# Altium project BLDC.PrjPcb
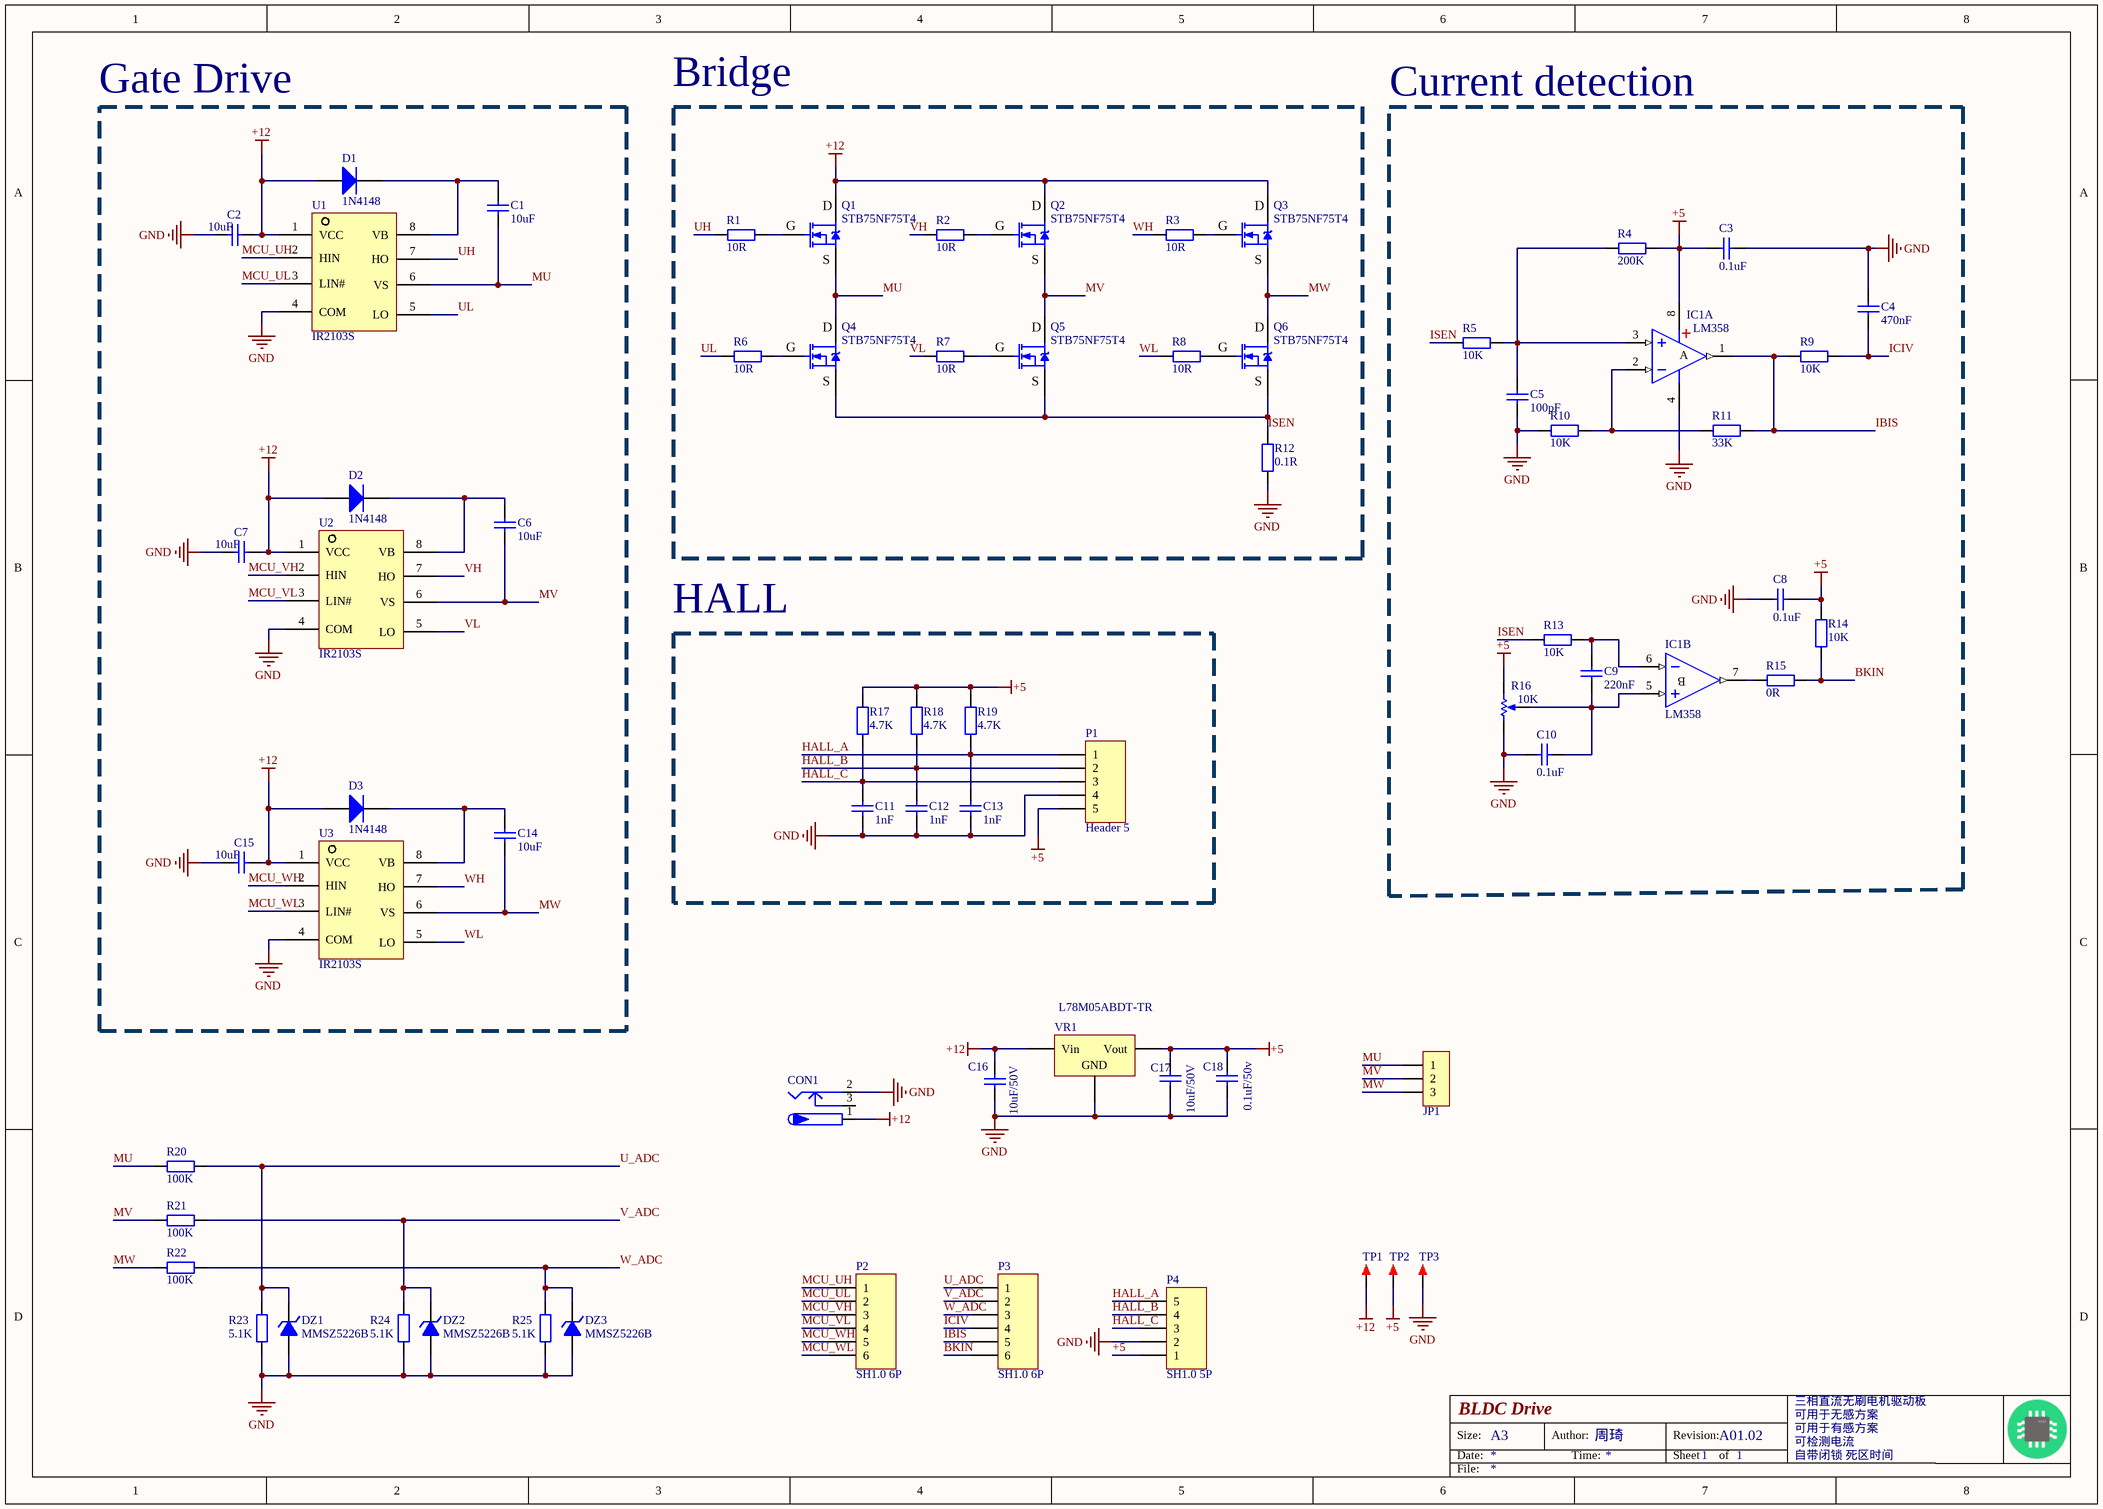
[diagram p0: 原理图.SchDoc]
1 sheet, 69 parts. Net scope: global (net labels, ports and power ports of the same name join across sheets).
Board file: PCB.PcbDoc

## Sheet 原理图.SchDoc: BLDC Drive
size A3; Author: 周琦; Organization: 三相直流无刷电机驱动板; Address1: 可用于无感方案; Address2: 可用于有感方案; Address3: 可检测电流; Address4: 自带闭锁 死区时间; Revision: A01.02; SheetNumber: 1; SheetTotal: 1; ImagePath: 1

### Parts
C1  10uF  [C0603_L]
C2  10uF  [C0603_L]
C3  0.1uF  [C0603_L]
C4  470nF  [C0603_L]
C5  100pF  [C0603_L]
C6  10uF  [C0603_L]
C7  10uF  [C0603_L]
C8  0.1uF  [C0603_L]
C9  220nF  [C0603_L]
C10  0.1uF  [C0603_L]
C11  1nF  [C0603_L]
C12  1nF  [C0603_L]
C13  1nF  [C0603_L]
C14  10uF  [C0603_L]
C15  10uF  [C0603_L]
C16  10uF/50V  [C1206_L]
C17  10uF/50V  [C1206_L]
C18  0.1uF/50v  [C0603_L]
CON1  3.5*1.3  [DC-005]  (value not drawn)
D1  1N4148  [SOD-123]
D2  1N4148  [SOD-123]
D3  1N4148  [SOD-123]
DZ1  MMSZ5226B  [SOD-123]
DZ2  MMSZ5226B  [SOD-123]
DZ3  MMSZ5226B  [SOD-123]
IC1  LM358  [SOP8_N]  (parts A,B of 2)
JP1  HDR-1X3  [KF350-3P]  (value not drawn)
P1  Header 5  [SH 1.0-LS-5P]
P2  SH1.0 6P  [SH 1.0-WS-6P]
P3  SH1.0 6P  [SH 1.0-WS-6P]
P4  SH1.0 5P  [SH 1.0-LS-5P]
Q1  STB75NF75T4  [TO252]
Q2  STB75NF75T4  [TO252]
Q3  STB75NF75T4  [TO252]
Q4  STB75NF75T4  [TO252]
Q5  STB75NF75T4  [TO252]
Q6  STB75NF75T4  [TO252]
R1  10R  [R0603_L]
R2  10R  [R0603_L]
R3  10R  [R0603_L]
R4  200K  [R0603_L]
R5  10K  [R0603_L]
R6  10R  [R0603_L]
R7  10R  [R0603_L]
R8  10R  [R0603_L]
R9  10K  [R0603_L]
R10  10K  [R0603_L]
R11  33K  [R0603_L]
R12  0.1R  [R2512_M]
R13  10K  [R0603_L]
R14  10K  [R0603_L]
R15  0R  [R0603_L]
R16  value 10K  [3303W]  (hidden comment: RPot)
R17  4.7K  [R0603_L]
R18  4.7K  [R0603_L]
R19  4.7K  [R0603_L]
R20  100K  [R1206_L]
R21  100K  [R1206_L]
R22  100K  [R1206_L]
R23  5.1K  [R0805_L]
R24  5.1K  [R0805_L]
R25  5.1K  [R0805_L]
TP1  TEST  [TEST 1.6]  (value not drawn)
TP2  TEST  [TEST 1.6]  (value not drawn)
TP3  TEST  [TEST 1.6]  (value not drawn)
U1  IR2103S  [SOP8]
U2  IR2103S  [SOP8]
U3  IR2103S  [SOP8]
VR1  L78M05ABDT-TR  [TO-252]

### Blocks framed on the sheet
Gate Drive: C1 C2 C6 C7 C14 C15 D1-D3 U1-U3
Bridge: Q1-Q6 R1-R3 R6-R8 R12
HALL: C11-C13 P1 R17-R19

### Nets
+5: C3.1 C8.1 C17.2 C18.2 IC1.8(V+) P1.5 P4.1 R4.1 R14.1 R16.2(BOT) R17.2 R18.2 R19.2 TP2.1 VR1.3(Vout)
+12: C2.2 C7.2 C15.2 C16.2 CON1.1 D1.1(A) D2.1(A) D3.1(A) Q1.2(D) Q2.2(D) Q3.2(D) TP1.1 U1.1(VCC) U2.1(VCC) U3.1(VCC) VR1.1(Vin)
GND: C2.1 C3.2 C4.1 C5.2 C7.1 C8.2 C10.2 C11.1 C12.1 C13.1 C15.1 C16.1 C17.1 C18.1 CON1.2 DZ1.1(A) DZ2.1(A) DZ3.1(A) IC1.4(V-) P1.4 P4.2 R10.2 R12.1 R16.1(TOP) R23.1 R24.1 R25.1 TP3.1 U1.4(COM) U2.4(COM) U3.4(COM) VR1.2(GND)
BKIN: P3.6 R14.2 R15.1
HALL_A: C13.2 P1.1 P4.5 R19.1
HALL_B: C12.2 P1.2 P4.4 R18.1
HALL_C: C11.2 P1.3 P4.3 R17.1
IBIS: IC1.1(OUT) P3.5 R9.2 R11.1
ICIV: C4.2 P3.4 R9.1
ISEN: Q4.3(S) Q5.3(S) Q6.3(S) R5.2 R12.2 R13.2
MCU_UH: P2.1 U1.2(HIN)
MCU_UL: P2.2 U1.3(LIN#)
MCU_VH: P2.3 U2.2(HIN)
MCU_VL: P2.4 U2.3(LIN#)
MCU_WH: P2.5 U3.2(HIN)
MCU_WL: P2.6 U3.3(LIN#)
MU: C1.1 JP1.1 Q1.3(S) Q4.2(D) R20.1 U1.6(VS)
MV: C6.1 JP1.2 Q2.3(S) Q5.2(D) R21.1 U2.6(VS)
MW: C14.1 JP1.3 Q3.3(S) Q6.2(D) R22.1 U3.6(VS)
U_ADC: DZ1.2(K) P3.1 R20.2 R23.2
UH: R1.1 U1.7(HO)
UL: R6.1 U1.5(LO)
V_ADC: DZ2.2(K) P3.2 R21.2 R24.2
VH: R2.1 U2.7(HO)
VL: R7.1 U2.5(LO)
W_ADC: DZ3.2(K) P3.3 R22.2 R25.2
WH: R3.1 U3.7(HO)
WL: R8.1 U3.5(LO)
NetC1_2: C1.2 D1.2(K) U1.8(VB)
NetC5_1: C5.1 IC1.3(IN+) R4.2 R5.1
NetC6_2: C6.2 D2.2(K) U2.8(VB)
NetC9_1: C9.1 C10.1 IC1.5(IN+) R16.3(TAP)
NetC9_2: C9.2 IC1.6(IN-) R13.1
NetC14_2: C14.2 D3.2(K) U3.8(VB)
NetIC1_2: IC1.2(IN-) R10.1 R11.2
NetIC1_7: IC1.7(OUT) R15.2
NetQ1_1: Q1.1(G) R1.2
NetQ2_1: Q2.1(G) R2.2
NetQ3_1: Q3.1(G) R3.2
NetQ4_1: Q4.1(G) R6.2
NetQ5_1: Q5.1(G) R7.2
NetQ6_1: Q6.1(G) R8.2

Not connected (* = marked no-connect by the designer): CON1 3

### Notes on the sheet
- Current detection
- Size:
- Date:
- A3
- Author:
- Time:
- Revision:
- Sheet
- of
- File:
- (in symbol LM358, part A) A
- (in symbol LM358, part B) B

### Library data of the parts
C1-C15 = C: 贴片电容; BOM名称: 无极性贴片电容; 联系卖家，免费查找封装: 唯一出售店铺网址https://shop463601444.taobao.com
C16 C17 = Cap: C89632; LC: C1591; parm: 100V
C18 = Cap
CON1 = P-DC: 低压电源接口; BOM名称: DC电源接口; 联系卖家，免费技术支持: 唯一出售店铺网址https://shop463601444.taobao.com
D1-D3 = SOD-323 1N4148WS T4: 二极管; ComponentLink1Description: 供应商链接; ComponentLink1URL: http://www.szlcsc.com/product/details_2485.html; Package: SOD-323; Supplier: LC; SuppliersPartNumber: C2128
DZ1-DZ3 = 1N4619: 3V/0.5W稳压管; 联系卖家，免费查找封装: 唯一出售店铺网址https://shop463601444.taobao.com; BOM名称: 3V/0.5W稳压管
IC1 = LM358: 双路运放; 联系卖家，免费查找封装: 唯一出售店铺网址https://shop463601444.taobao.com; BOM名称: 双路运放
JP1 = Header 3: 3P接插件; 版权归属: 源创客; BOM名称: 3P接插件; 学习资源: www.ooocke.com
P1 P4 = Header 5: Header, 5-Pin; LatestRevisionDate: 17-Jul-2002; LatestRevisionNote: Re-released for DXP Platform.; Publisher: Altium Limited
P2 P3 = Header 6: Header, 6-Pin; LatestRevisionDate: 17-Jul-2002; LatestRevisionNote: Re-released for DXP Platform.; Publisher: Altium Limited
Q1-Q6 = IRFR024NTRPBF: N沟道 55V/17A; BOM名称: N沟场效应管; 联系卖家，免费查找封装: 唯一出售店铺网址https://shop463601444.taobao.com; 封装库来自淘宝卖家 ID：黄晶宝石: 其他店铺购入均为盗版，不享受售后技术支持服务，请立即申请退款; 参数: 55V,17A,75mΩ@10V
R1-R15 R17-R25 = R: 贴片电阻; 联系卖家，免费查找封装: 唯一出售店铺网址https://shop463601444.taobao.com; 封装库来自淘宝卖家ID：黄晶宝石: 其他店铺购入均为盗版假冒封装库，请立即申请退款; BOM名称: 贴片电阻
R16 = RPot: Potentiometer; Sim Note: Enter the Resistance value and the set point into parameter fields.; Set Position: 0.5; Published: 8-Jun-2000; LatestRevisionDate: 17-Jul-2002; LatestRevisionNote: Re-released for DXP Platform.; PackageReference: VR5; Publisher: Altium Limited; PackageDescription: Variable Resistor, Thru-Hole; 3 Leads
TP1-TP3 = TEST: 测试点; 联系卖家，免费查找封装: 唯一出售店铺网址https://shop463601444.taobao.com; BOM名称: 测试点
U1-U3 = IR2103S: 栅极驱动，SOP-8
VR1 = TO-252-2 L78M05ABDT-TR: 低压差线性稳压(LDO); ComponentLink1Description: 供应商链接; ComponentLink1URL: http://www.szlcsc.com/product/details_59107.html; Package: TO-252-2; Supplier: LC; SuppliersPartNumber: C58069